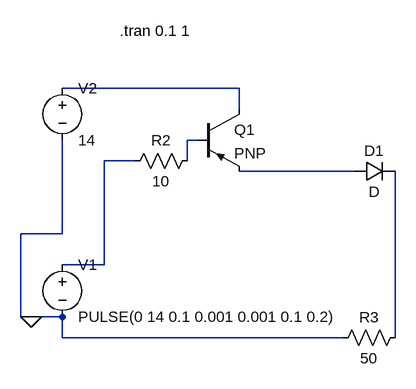
[diagram p0: schematic NPN.asc]
NPN.asc, the LTspice schematic file:
Version 4
SHEET 1 880 680
WIRE 448 144 176 144
WIRE 448 176 448 144
WIRE 384 224 368 224
WIRE 288 256 240 256
WIRE 368 256 368 224
WIRE 624 272 448 272
WIRE 176 368 176 224
WIRE 176 368 112 368
WIRE 240 416 240 256
WIRE 240 416 176 416
WIRE 112 496 112 368
WIRE 128 496 112 496
WIRE 176 496 128 496
WIRE 176 528 176 496
WIRE 608 528 176 528
WIRE 688 528 688 272
FLAG 128 496 0
SYMBOL voltage 176 400 R0
SYMATTR InstName V1
SYMATTR Value PULSE(0 14 0.1 0.001 0.001 0.1 0.2)
SYMBOL voltage 176 128 R0
SYMATTR InstName V2
SYMATTR Value 14
SYMBOL res 384 240 R90
WINDOW 0 0 56 VBottom 2
WINDOW 3 32 56 VTop 2
SYMATTR InstName R2
SYMATTR Value 10
SYMBOL diode 624 288 R270
WINDOW 0 32 32 VTop 2
WINDOW 3 0 32 VBottom 2
SYMATTR InstName D1
SYMBOL res 704 512 R90
WINDOW 0 0 56 VBottom 2
WINDOW 3 32 56 VTop 2
SYMATTR InstName R3
SYMATTR Value 50
SYMBOL pnp 384 176 R0
SYMATTR InstName Q1
TEXT 264 56 Left 2 !.tran 0.1 1

The netlist it stands for:
* NPN.asc
V1 N003 0 PULSE(0 14 0.1 0.001 0.001 0.1 0.2)
V2 N001 0 14
R2 N002 N003 10
D1 N004 N005 D
R3 N005 0 50
Q1 N001 N002 N004 0 PNP
.model D D
.lib standard.dio
.model NPN NPN
.model PNP PNP
.lib standard.bjt
.tran 0.1 1
.backanno
.end